# EAGLE schematic logic (EAGLE 9.2.2)
Assembly variants: BASIC
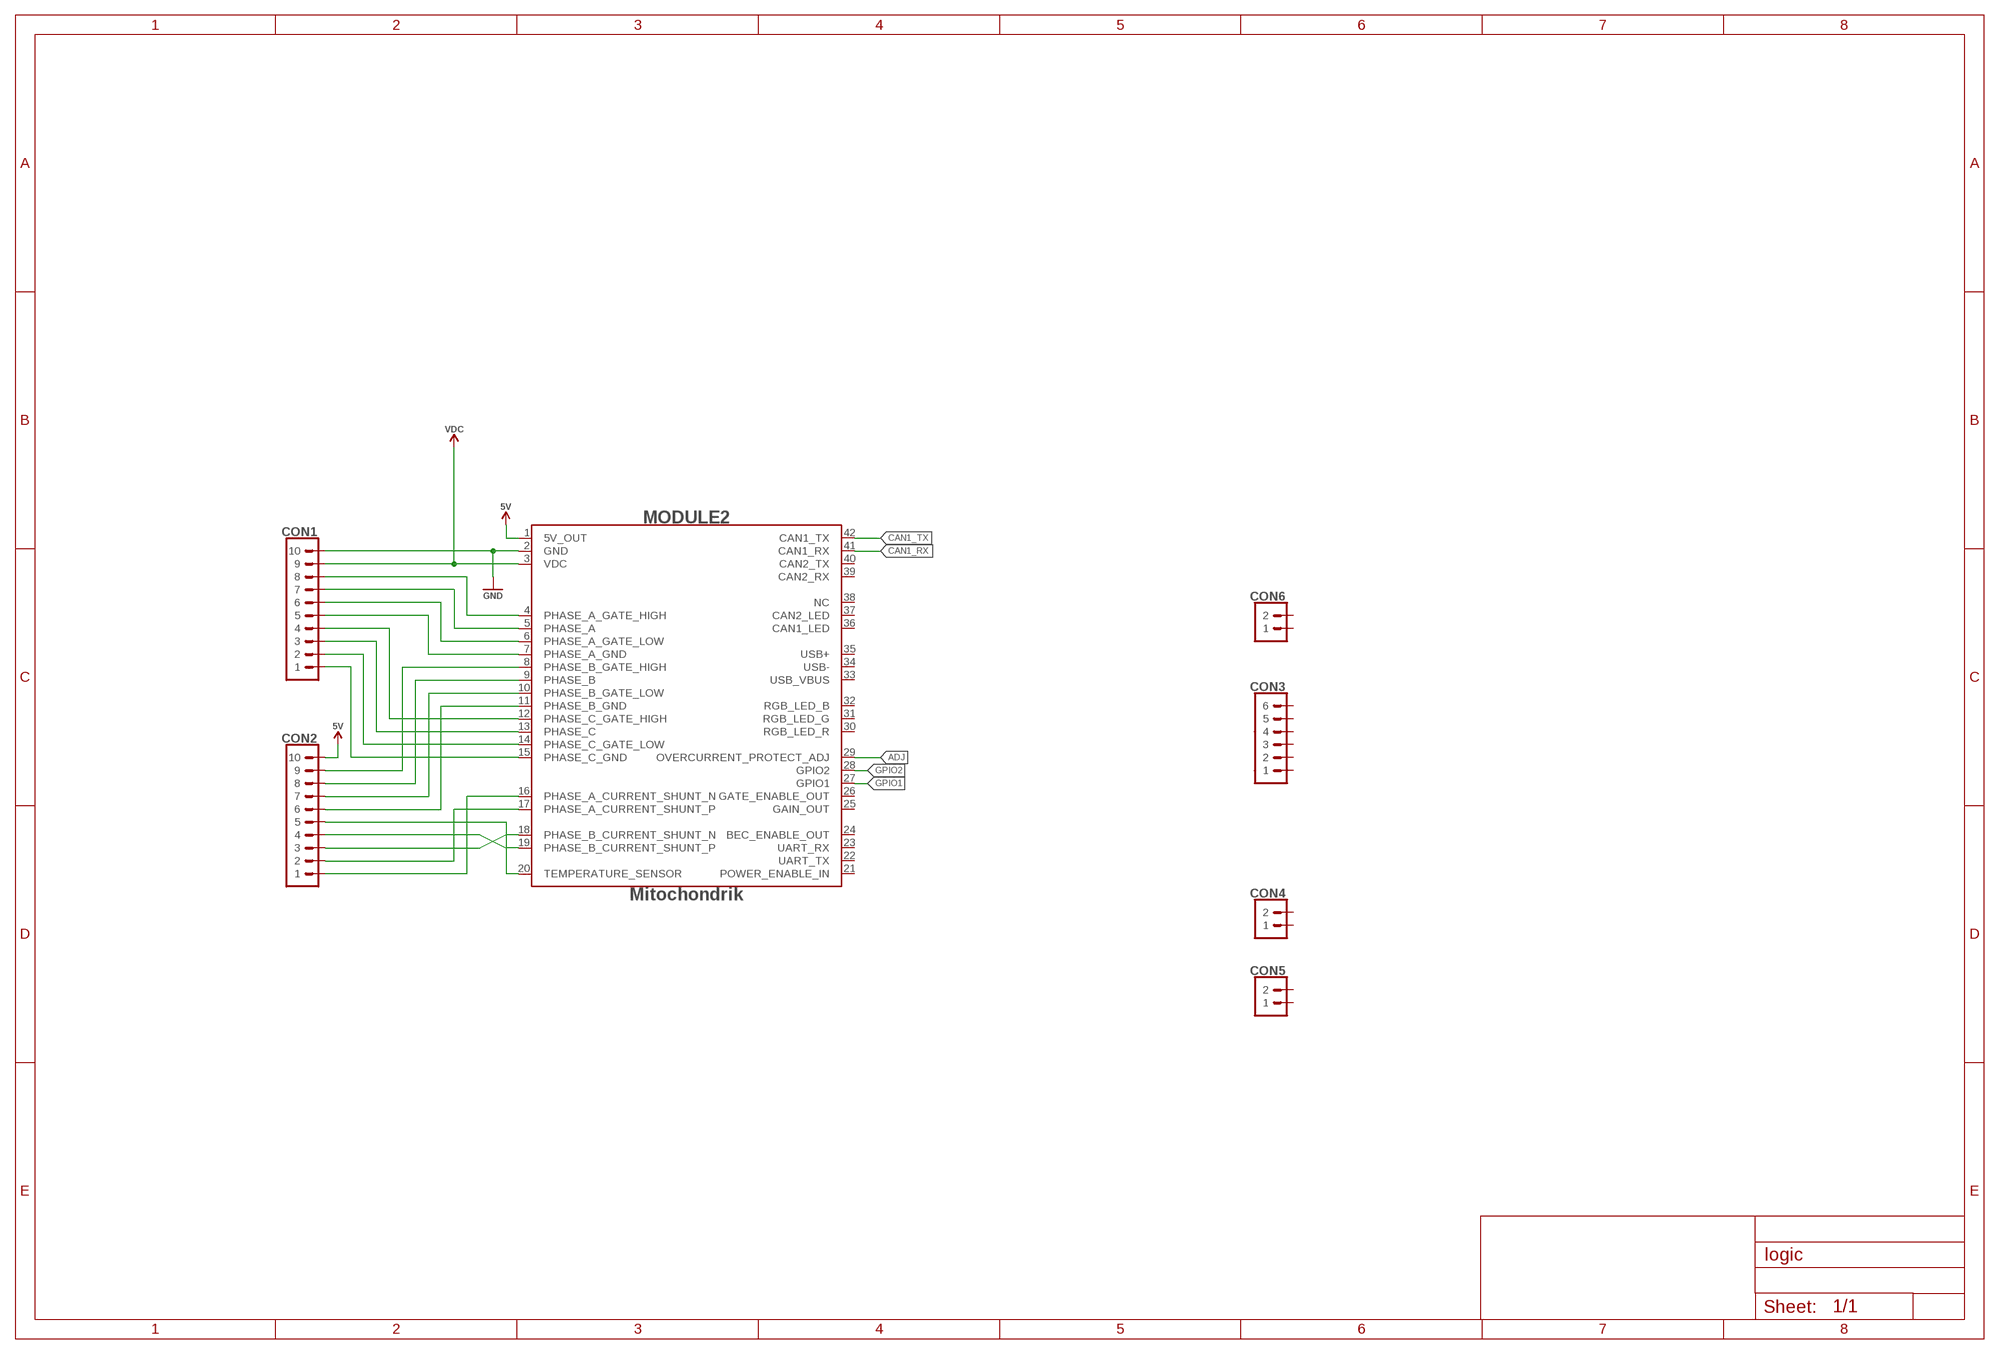
[diagram p0: schematic, sheet 1]

## Parts
CON1  PINHEAD_1X10-2  [1X10-PTH_2]
CON2  PINHEAD_1X10-2  [1X10-PTH_2]
CON3  PINHEAD_1X06-2  [1X06-PTH-2]
CON4  PINHEAD_1X02-2  [1X02-PTH-2]
CON5  PINHEAD_1X02-2  [1X02-PTH-2]
CON6  PINHEAD_1X02-2  [1X02-PTH-2]
MODULE2  MITOHONDRIQUE-TH  [MITOHONDRIQUE]

## Nets
ADJ: MODULE2.29(OVERCURRENT_PROTECT_ADJ)
CAN1_RX: MODULE2.41(CAN1_RX)
CAN1_TX: MODULE2.42(CAN1_TX)
GND: CON1.10 MODULE2.2(GND)
GPIO1: MODULE2.27(GPIO1)
GPIO2: MODULE2.28(GPIO2)
N$1: CON2.3 MODULE2.18(PHASE_B_CURRENT_SHUNT_N)
N$2: CON2.2 MODULE2.17(PHASE_A_CURRENT_SHUNT_P)
N$3: CON2.1 MODULE2.16(PHASE_A_CURRENT_SHUNT_N)
N$4: CON2.4 MODULE2.19(PHASE_B_CURRENT_SHUNT_P)
N$5: CON1.1 MODULE2.15(PHASE_C_GND)
PHASE_A [HV]: CON1.7 MODULE2.5(PHASE_A)
PHASE_A_GATE_HIGH [HV]: CON1.8 MODULE2.4(PHASE_A_GATE_HIGH)
PHASE_A_GATE_LOW: CON1.6 MODULE2.6(PHASE_A_GATE_LOW)
PHASE_A_GND: CON1.5 MODULE2.7(PHASE_A_GND)
PHASE_B [HV]: CON1.3 MODULE2.13(PHASE_C)
PHASE_B_GATE_HIGH [HV]: CON1.4 MODULE2.12(PHASE_C_GATE_HIGH)
PHASE_B_GATE_LOW: CON1.2 MODULE2.14(PHASE_C_GATE_LOW)
PHASE_C [HV]: CON2.8 MODULE2.9(PHASE_B)
PHASE_C_GATE_HIGH [HV]: CON2.9 MODULE2.8(PHASE_B_GATE_HIGH)
PHASE_C_GATE_LOW: CON2.7 MODULE2.10(PHASE_B_GATE_LOW)
PHASE_C_GND: CON2.6 MODULE2.11(PHASE_B_GND)
TEMPERATURE_SENSOR: CON2.5 MODULE2.20(TEMPERATURE_SENSOR)
VDC [HV]: CON1.9 MODULE2.3(VDC)
VDD_5V: CON2.10 MODULE2.1(5V_OUT) ; supply symbol labelled 5V
Unconnected: CON3.1 CON3.2 CON3.3 CON3.4 CON3.5 CON3.6 CON4.1 CON4.2 CON5.1 CON5.2 CON6.1 CON6.2 MODULE2.21(POWER_ENABLE_IN) MODULE2.22(UART_TX) MODULE2.23(UART_RX) MODULE2.24(BEC_ENABLE_OUT) MODULE2.25(GAIN_OUT) MODULE2.26(GATE_ENABLE_OUT) MODULE2.30(RGB_LED_R) MODULE2.31(RGB_LED_G) MODULE2.32(RGB_LED_B) MODULE2.33(USB_VBUS) MODULE2.34(USB-) MODULE2.35(USB+) MODULE2.36(CAN1_LED) MODULE2.37(CAN2_LED) MODULE2.38(NC) MODULE2.39(CAN2_RX) MODULE2.40(CAN2_TX)

## Library data of the parts
CON1 CON2 = pinhead:PINHEAD_1X10
CON3 = pinhead:PINHEAD_1X06: pinheader 6P
CON4-CON6 = pinhead:PINHEAD_1X02: pinheader 2P
MODULE2 = zubax_modules:MITOHONDRIQUE; MANF: Zubax Robotics; MANF#: Mitochondrik

## Net classes
1 HV: clearance 0.25 mm to class 0, clearance 0.25 mm